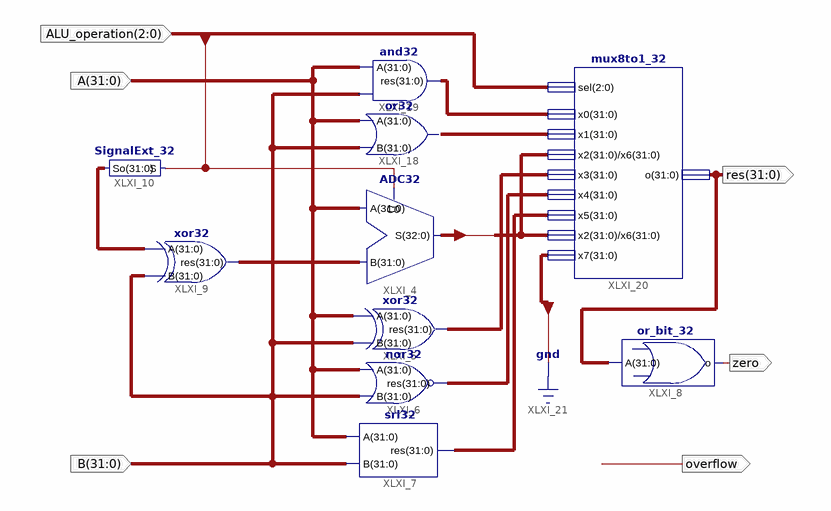
[diagram p0: schematic sheet 1]
// Xilinx ISE schematic ALU.sch (spartan3) as structural Verilog: 10 symbols, 6 ports
module ALU (
  input  [31:0] B,
  input  [31:0] A,
  input  [2:0] ALU_operation,
  output [31:0] res,
  output zero,
  output overflow
);

  wire [31:0] XLXN, XLXN_11, XLXN_19, XLXN_21, XLXN_22, XLXN_28, XLXN_30;
  wire [32:0] S;

  srl32 XLXI_7 (.A(A), .B(B), .res(XLXN_30));
  or_bit_32 XLXI_8 (.o(zero), .A(res));
  nor32 XLXI_6 (.res(XLXN), .A(A), .B(B));
  xor32 XLXI_5 (.A(A), .B(B), .res(XLXN_28));
  ADC32 XLXI_4 (.B(XLXN_11), .A(A), .C0(ALU_operation[2]), .S(S));
  SignalExt_32 XLXI_10 (.So(XLXN_19), .S(ALU_operation[2]));
  xor32 XLXI_9 (.A(XLXN_19), .B(B), .res(XLXN_11));
  or32 XLXI_18 (.res(XLXN_22), .A(A), .B(B));
  and32 XLXI_19 (.res(XLXN_21), .A(A), .B(B));
  mux8to1_32 XLXI_20 (
    .x1(XLXN_22), .sel(ALU_operation), .o(res), .x0(XLXN_21), .x2(S[31:0]), .x3(XLXN_28), .x4(XLXN),
    .x5(XLXN_30), .x6(S[31:0]), .x7({{31{1'b0}}, S[32]}));
endmodule
